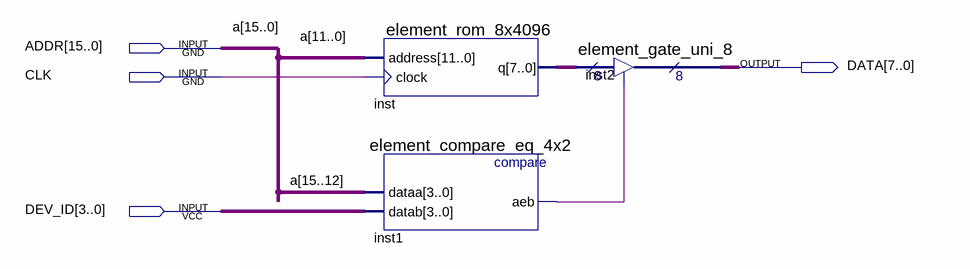
[diagram p0: schematic sheet]
// Quartus schematic block-rom.bdf as structural Verilog: 3 symbols, 4 pins
module \block-rom  (
  input  [15:0] ADDR,
  input  CLK,
  input  [3:0] DEV_ID,
  output [7:0] DATA
);

  wire inst1_aeb;
  wire [7:0] inst_q;

  element_rom_8x4096 inst (.address(ADDR[11:0]), .clock(CLK), .q(inst_q));
  element_compare_eq_4x2 inst1 (.dataa(ADDR[15:12]), .datab(DEV_ID), .aeb(inst1_aeb));
  element_gate_uni_8 inst2 (.enabledt(inst1_aeb), .data(inst_q), .tridata(DATA));

  // Other names for the same wires on the sheet: a[15:0] = ADDR
endmodule
